# Altium schematic sheet POWER.SchDoc
size A4; SheetNumber: 3; SheetTotal: 4
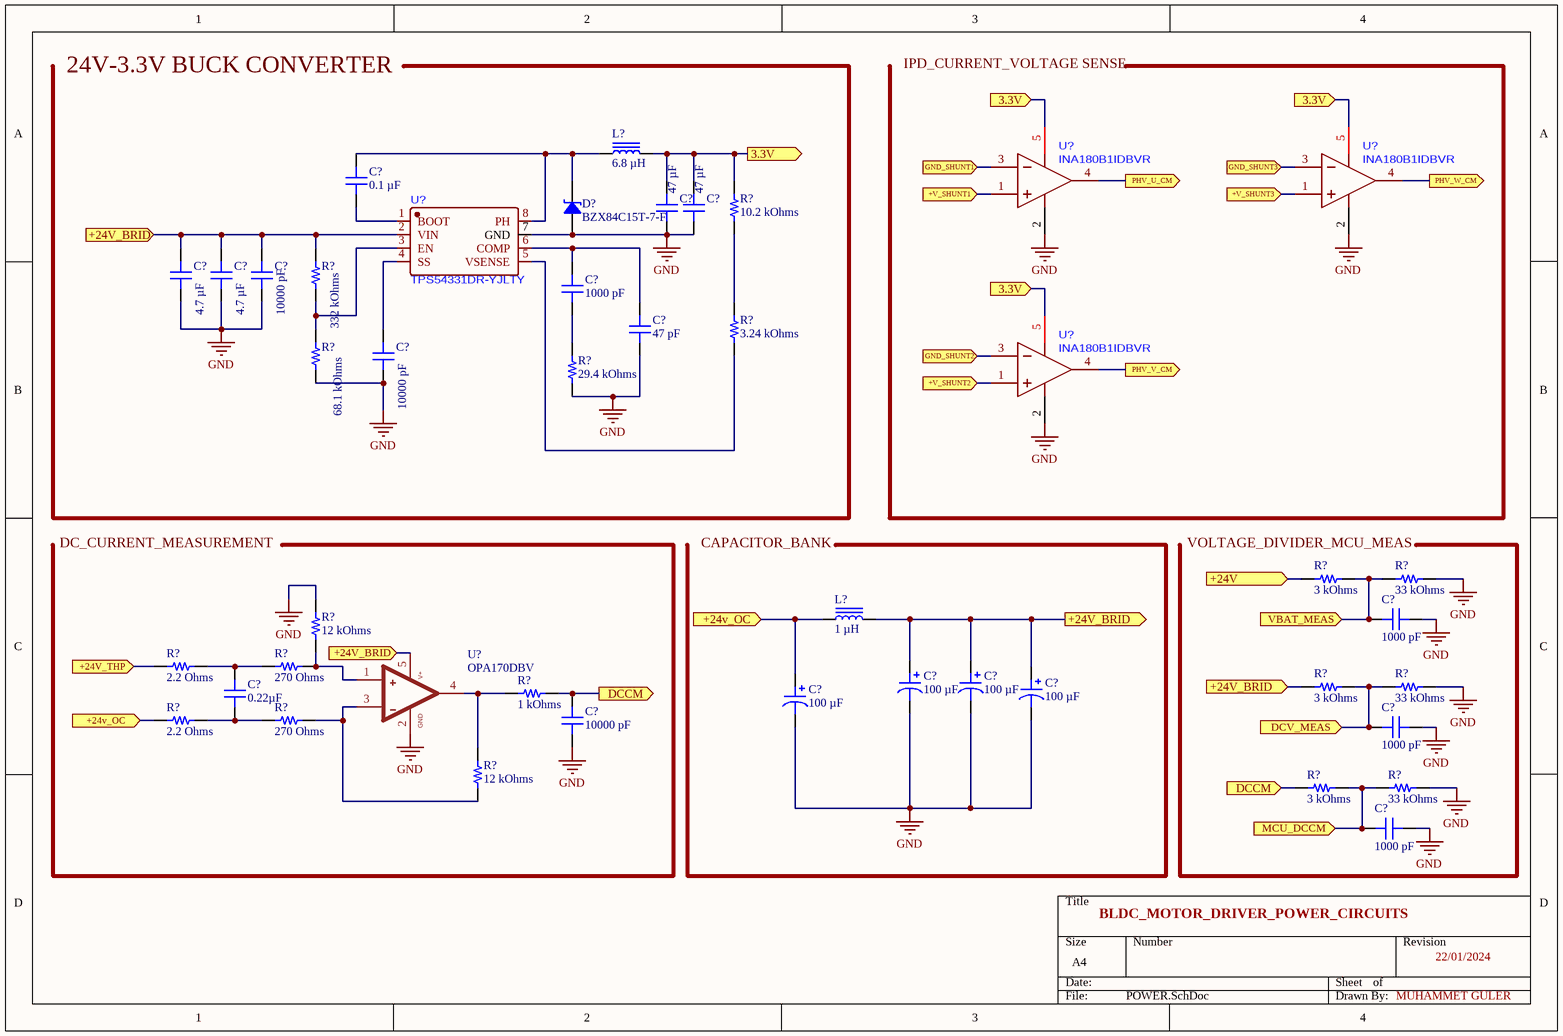
[diagram p0: POWER.SchDoc]

## Parts
(Parts that share a designator on the sheet are numbered #1, #2 ... from top to bottom, then left to right.)
C?#1  0.1 µF  [CAP 1210_3225 - 1MM]
C?#2  47 µF  [CAP 1210_3225 - 1MM]
C?#3  47 µF  [CAP 1210_3225 - 1MM]
C?#4  4.7 µF  [CAP 1210_3225 - 1MM]
C?#5  4.7 µF  [CAP 1210_3225 - 1MM]
C?#6  10000 pF  [CAP 1210_3225 - 1MM]
C?#7  1000 pF  [CAP 1210_3225 - 1MM]
C?#8  47 pF  [CAP 1210_3225 - 1MM]
C?#9  10000 pF  [CAP 1210_3225 - 1MM]
C?#10  1000 pF  [CAP 1210_3225 - 1MM]
C?#11  100 µF  [CAP ALSMD POLY 5.3MM H5.7MM]
C?#12  100 µF  [CAP ALSMD POLY 5.3MM H5.7MM]
C?#13  0.22µF  [CAP 1210_3225 - 2.8MM]
C?#14  100 µF  [CAP ALSMD POLY 5.3MM H5.7MM]
C?#15  100 µF  [CAP ALSMD POLY 5.3MM H5.7MM]
C?#16  10000 pF  [CAP 1210_3225 - 1MM]
C?#17  1000 pF  [CAP 1210_3225 - 1MM]
C?#18  1000 pF  [CAP 1210_3225 - 1MM]
D?  BZX84C15T-7-F  [DIODES SOT-523]
L?#1  6.8 µH  [BOURNS SRP5030T]
L?#2  1 µH  [BOURNS SRP5030T]
R?#1  10.2 kOhms  [RES 1210_3225]
R?#2  332 kOhms  [RES 1210_3225]
R?#3  3.24 kOhms  [RES 1210_3225]
R?#4  68.1 kOhms  [RES 1210_3225]
R?#5  29.4 kOhms  [RES 1210_3225]
R?#6  3 kOhms  [RES 1210_3225]
R?#7  33 kOhms  [RES 1210_3225]
R?#8  12 kOhms  [RES 1210_3225]
R?#9  2.2 Ohms  [RES 1210_3225]
R?#10  270 Ohms  [RES 1210_3225]
R?#11  3 kOhms  [RES 1210_3225]
R?#12  33 kOhms  [RES 1210_3225]
R?#13  1 kOhms  [RES 1210_3225]
R?#14  2.2 Ohms  [RES 1210_3225]
R?#15  270 Ohms  [RES 1210_3225]
R?#16  12 kOhms  [RES 1210_3225]
R?#17  3 kOhms  [RES 1210_3225]
R?#18  33 kOhms  [RES 1210_3225]
U?#1  INA180B1IDBVR  [SOT-23-5_L2.9-W1.6-P0.95-LS2.8-BR]
U?#2  INA180B1IDBVR  [SOT-23-5_L2.9-W1.6-P0.95-LS2.8-BR]
U?#3  TPS54331DR-YJLTY  [SOIC-8_TPS54331]
U?#4  INA180B1IDBVR  [SOT-23-5_L2.9-W1.6-P0.95-LS2.8-BR]
U?#5  OPA170DBV  [SOT-23-5_L2.9-W1.6-P0.95-LS2.8-BR]

## Ports
3.3V (in, see DRIVER[3A], DRIVER[4B], MCU[1B], MCU[1C], MCU[1D], MCU[2A], MCU[2B], MCU[2C], MCU[2D], MCU[3A], MCU[3B], MCU[3D], MCU[4A], MCU[4C], POWER[2A], POWER[3A], POWER[3B], PROTECTION[2D], PROTECTION[4A], PROTECTION[4B]), 3.3V (in, see DRIVER[3A], DRIVER[4B], MCU[1B], MCU[1C], MCU[1D], MCU[2A], MCU[2B], MCU[2C], MCU[2D], MCU[3A], MCU[3B], MCU[3D], MCU[4A], MCU[4C], POWER[2A], POWER[3A], POWER[4A], PROTECTION[2D], PROTECTION[4A], PROTECTION[4B]), 3.3V (in, see DRIVER[3A], DRIVER[4B], MCU[1B], MCU[1C], MCU[1D], MCU[2A], MCU[2B], MCU[2C], MCU[2D], MCU[3A], MCU[3B], MCU[3D], MCU[4A], MCU[4C], POWER[2A], POWER[3B], POWER[4A], PROTECTION[2D], PROTECTION[4A], PROTECTION[4B]), 3.3V (out, see DRIVER[3A], DRIVER[4B], MCU[1B], MCU[1C], MCU[1D], MCU[2A], MCU[2B], MCU[2C], MCU[2D], MCU[3A], MCU[3B], MCU[3D], MCU[4A], MCU[4C], POWER[3A], POWER[3B], POWER[4A], PROTECTION[2D], PROTECTION[4A], PROTECTION[4B]), +24V (in, see PROTECTION[1A]), +24V_BRID (in, see DRIVER[2A], DRIVER[2C], DRIVER[3C], POWER[1A], POWER[1C], POWER[3C]), +24V_BRID (in, see DRIVER[2A], DRIVER[2C], DRIVER[3C], POWER[1A], POWER[3C], POWER[4C]), +24V_BRID (in, see DRIVER[2A], DRIVER[2C], DRIVER[3C], POWER[1C], POWER[3C], POWER[4C]), +24V_BRID (out, see DRIVER[2A], DRIVER[2C], DRIVER[3C], POWER[1A], POWER[1C], POWER[4C]), +24v_OC (in, see POWER[1C], PROTECTION[3B], PROTECTION[3D]), +24v_OC (in, see POWER[2C], PROTECTION[3B], PROTECTION[3D]), +24V_THP (in, see PROTECTION[4B]), +V_SHUNT1 (in, see DRIVER[2B]), +V_SHUNT2 (in, see DRIVER[2D]), +V_SHUNT3 (in, see DRIVER[3D]), DCCM (in, see POWER[2C]), DCCM (out, see POWER[4D]), DCV_MEAS (in, see MCU[3A]), GND_SHUNT1 (in, see DRIVER[2B]), GND_SHUNT2 (in, see DRIVER[2D]), GND_SHUNT3 (in, see DRIVER[3D]), MCU_DCCM (in, see MCU[3B]), PHV_U_CM (out, see MCU[2B], PROTECTION[4A]), PHV_V_CM (out, see MCU[2B], PROTECTION[4A]), PHV_W_CM (out, see MCU[2B], PROTECTION[4A]), VBAT_MEAS (in, see MCU[2B])

## Nets
GND: C?#2.2 C?#3.2 C?#4.2 C?#5.2 C?#6.2 C?#8.2 C?#9.2 C?#10.2 C?#11.2 C?#12.2 C?#14.2 C?#15.2 C?#16.2 C?#17.2 C?#18.2 D?.1 R?#4.2 R?#5.2 R?#7.2 R?#8.1 R?#12.2 R?#18.2 U?#1.2(GND) U?#2.2(GND) U?#3.7(GND) U?#4.2(GND) U?#5.2(GND)
3.3V: C?#2.1 C?#3.1 L?#1.2 R?#1.1 U?#1.5(VS) U?#2.5(VS) U?#4.5(VS) ; port 3.3V
+24V: R?#6.2 ; port +24V
+24V_BRID: C?#4.1 C?#5.1 C?#6.1 C?#11.1 C?#12.1 C?#14.1 L?#2.2 R?#2.1 R?#11.2 U?#3.2(VIN) U?#5.5(V+) ; port +24V_BRID
+24v_OC: C?#15.1 L?#2.1 R?#14.1 ; port +24v_OC
+24V_THP: R?#9.1 ; port +24V_THP
+V_SHUNT1: U?#1.1(IN+) ; port +V_SHUNT1
+V_SHUNT2: U?#4.1(IN+) ; port +V_SHUNT2
+V_SHUNT3: U?#2.1(IN+) ; port +V_SHUNT3
DCCM: C?#16.1 R?#13.2 R?#17.2 ; port DCCM
DCV_MEAS: C?#17.1 R?#11.1 R?#12.1 ; port DCV_MEAS
GND_SHUNT1: U?#1.3(IN-) ; port GND_SHUNT1
GND_SHUNT2: U?#4.3(IN-) ; port GND_SHUNT2
GND_SHUNT3: U?#2.3(IN-) ; port GND_SHUNT3
MCU_DCCM: C?#18.1 R?#17.1 R?#18.1 ; port MCU_DCCM
PHV_U_CM: U?#1.4(OUT) ; port PHV_U_CM
PHV_V_CM: U?#4.4(OUT) ; port PHV_V_CM
PHV_W_CM: U?#2.4(OUT) ; port PHV_W_CM
VBAT_MEAS: C?#10.1 R?#6.1 R?#7.1 ; port VBAT_MEAS
NetC?#1_1: C?#1.1 D?.2 L?#1.1 U?#3.8(PH)
NetC?#1_2: C?#1.2 U?#3.1(BOOT)
NetC?#7_1: C?#7.1 C?#8.1 U?#3.6(COMP)
NetC?#7_2: C?#7.2 R?#5.1
NetC?#9_1: C?#9.1 U?#3.4(SS)
NetC?#13_1: C?#13.1 R?#9.2 R?#10.1
NetC?#13_2: C?#13.2 R?#14.2 R?#15.1
NetR?#1_2: R?#1.2 R?#3.1
NetR?#2_2: R?#2.2 R?#4.1 U?#3.3(EN)
NetR?#3_2: R?#3.2 U?#3.5(VSENSE)
NetR?#8_2: R?#8.2 R?#10.2 U?#5.1(+)
NetR?#13_1: R?#13.1 R?#16.1 U?#5.4(OUT)
NetR?#15_2: R?#15.2 R?#16.2 U?#5.3(-)

## Notes on the sheet
- 24V-3.3V BUCK CONVERTER
- IPD_CURRENT_VOLTAGE SENSE
- DC_CURRENT_MEASUREMENT
- CAPACITOR_BANK
- (near R?#6) VOLTAGE_DIVIDER_MCU_MEAS
- BLDC_MOTOR_DRIVER_POWER_CIRCUITS
- 22/01/2024
- MUHAMMET GÜLER

## Library data of the parts
C?#1 = CAN13X104KARAC7800: CAP CER 1210 0.1UF 250VAC X7R; manufacturer: KEMET; Tolerance: ±10%; Part Number: CAN13X104KARAC7800; Value: 0.1 µF; Applications: Boardflex Sensitive; Capacitance: 0.1 µF; componentlink1description: Datasheet; componentlink1url: //media.digikey.com/pdf/Data%20Sheets/Kemet%20PDFs/CAN13X104KARACTU_Spec.pdf; componentlink2description: DigiKey Link; componentlink2url: https://www.digikey.com/en/products/detail/kemet/CAN13X104KARAC7800/9962480; Device Package: 1210 (3225 Metric); Features: Soft Termination; lastupdated: 14.01.2024 20:41:00; Lifecycle Status: Active; Minimum Order: 1; Mounting Type: Surface Mount, MLCC; Operating Temperature: -55°C ~ 125°C; Package / Case: 1210 (3225 Metric); packaging: TapeAndReel; partid: 23615; Part Status: Active; price: 0.37; series: CAN SMD Indust X7R; Size / Dimension: 0.130" L x 0.102" W (3.30mm x 2.60mm); Supplier 1: DigiKey; Supplier Part Number 1: 399-20611-1-ND; Temperature Coefficient: X7R; Thickness (Max): 0.110" (2.80mm); Voltage - Rated: 250VAC
C?#2 C?#3 = GRM32EC81C476KE15L: CAP CER 47UF 16V X6S 1210; manufacturer: Murata Electronics; Tolerance: ±10%; Part Number: GRM32EC81C476KE15L; Value: 47 µF; Applications: General Purpose; Capacitance: 47 µF; componentlink1description: Datasheet; componentlink1url: https://search.murata.co.jp/Ceramy/image/img/A01X/G101/ENG/GRM32EC81C476KE15-01.pdf; componentlink2description: DigiKey Link; componentlink2url: https://www.digikey.com/en/products/detail/murata-electronics/GRM32EC81C476KE15L/5027615; Device Package: 1210 (3225 Metric); lastupdated: 14.01.2024 20:40:59; Lifecycle Status: Active; Minimum Order: 1; Mounting Type: Surface Mount, MLCC; Operating Temperature: -55°C ~ 105°C; Package / Case: 1210 (3225 Metric); packaging: TapeAndReel; partid: 23627; Part Status: Active; price: 0.10; series: GRM; Size / Dimension: 0.126" L x 0.098" W (3.20mm x 2.50mm); Supplier 1: DigiKey; Supplier Part Number 1: 490-10531-1-ND; Temperature Coefficient: X6S; Thickness (Max): 0.106" (2.70mm); Voltage - Rated: 16V
C?#4 C?#5 = UMK325B7475KMHP: CAP CER 4.7UF 50V X7R 1210; manufacturer: Taiyo Yuden; Tolerance: ±10%; Part Number: UMK325B7475KMHP; Value: 4.7 µF; Applications: Automotive, SMPS Filtering; Capacitance: 4.7 µF; componentlink1description: Datasheet; componentlink1url: https://ds.yuden.co.jp/TYCOMPAS/ut/detail?pn=UMK325B7475KMHP &u=M; componentlink2description: DigiKey Link; componentlink2url: https://www.digikey.com/en/products/detail/taiyo-yuden/UMK325B7475KMHP/7404006; Device Package: 1210 (3225 Metric); lastupdated: 14.01.2024 20:40:59; Lifecycle Status: Active; Minimum Order: 1; Mounting Type: Surface Mount, MLCC; Operating Temperature: -55°C ~ 125°C; Package / Case: 1210 (3225 Metric); packaging: TapeAndReel; partid: 23635; Part Status: Active; price: 0.16; Ratings: AEC-Q200; series: M; Size / Dimension: 0.126" L x 0.098" W (3.20mm x 2.50mm); Supplier 1: DigiKey; Supplier Part Number 1: 587-6032-1-ND; Temperature Coefficient: X7R; Thickness (Max): 0.106" (2.70mm); Voltage - Rated: 50V
C?#6 C?#9 = C1210C103KFRAC7800: CAP CER 10000PF 1.5KV X7R 1210; manufacturer: KEMET; Tolerance: ±10%; Voltage - Rated: 1500V (1.5kV); Part Number: C1210C103KFRAC7800; Value: 10000 pF; Applications: General Purpose; Capacitance: 10000 pF; componentlink1description: Datasheet; componentlink1url: https://api.kemet.com/component-edge/download/datasheet/C1210C103KFRAC7800.pdf; componentlink2description: DigiKey Link; componentlink2url: https://www.digikey.com/en/products/detail/kemet/C1210C103KFRAC7800/5879216; Device Package: 1210 (3225 Metric); Features: Low ESL, High Voltage; lastupdated: 14.01.2024 20:40:55; Lifecycle Status: Active; Minimum Order: 1; Mounting Type: Surface Mount, MLCC; Operating Temperature: -55°C ~ 125°C; Package / Case: 1210 (3225 Metric); packaging: TapeAndReel; partid: 24307; Part Status: Active; price: 0.41; series: SMD Comm X7R HV; Size / Dimension: 0.126" L x 0.098" W (3.20mm x 2.50mm); Supplier 1: DigiKey; Supplier Part Number 1: 399-13305-1-ND; Temperature Coefficient: X7R; Thickness (Max): 0.091" (2.30mm)
C?#7 = C3225C0G3A102J200AE: CAP CER 1000PF 1KV C0G/NP0 1210; manufacturer: TDK Corporation; Temperature Coefficient: C0G, NP0; Tolerance: ±5%; Voltage - Rated: 1000V (1kV); Part Number: C3225C0G3A102J200AE; Value: 1000 pF; Applications: Boardflex Sensitive; Capacitance: 1000 pF; componentlink1description: Datasheet; componentlink1url: https://product.tdk.com/info/en/catalog/datasheets/mlcc_commercial_soft_en.pdf?ref_disty=digikey; componentlink2description: DigiKey Link; componentlink2url: https://www.digikey.com/en/products/detail/tdk-corporation/C3225C0G3A102J200AE/8343800; Device Package: 1210 (3225 Metric); Features: Soft Termination, High Voltage; lastupdated: 14.01.2024 20:40:46; Lifecycle Status: Active; Minimum Order: 1; Mounting Type: Surface Mount, MLCC; Operating Temperature: -55°C ~ 125°C; Package / Case: 1210 (3225 Metric); packaging: TapeAndReel; partid: 24368; Part Status: Active; price: 0.46; series: C; Size / Dimension: 0.126" L x 0.098" W (3.20mm x 2.50mm); Supplier 1: DigiKey; Supplier Part Number 1: 445-175422-1-ND; Thickness (Max): 0.091" (2.30mm)
C?#8 = VJ1210A470JXGAT5Z: CAP CER 47PF 1KV C0G/NP0 1210; manufacturer: Vishay Vitramon; Temperature Coefficient: C0G, NP0; Tolerance: ±5%; Voltage - Rated: 1000V (1kV); Part Number: VJ1210A470JXGAT5Z; Value: 47 pF; Applications: General Purpose; Capacitance: 47 pF; componentlink1description: Datasheet; componentlink1url: http://www.vishay.com/docs/45197/vjhvarcguard.pdf; componentlink2description: DigiKey Link; componentlink2url: https://www.digikey.com/en/products/detail/vishay-vitramon/VJ1210A470JXGAT5Z/1559967; Device Package: 1210 (3225 Metric); Features: High Voltage; lastupdated: 14.01.2024 20:40:54; Lifecycle Status: Active; Minimum Order: 1; Mounting Type: Surface Mount, MLCC; Operating Temperature: -55°C ~ 125°C; Package / Case: 1210 (3225 Metric); packaging: CutTape; partid: 24733; Part Status: Active; price: 0.63; series: VJ HVArc Guard™; Size / Dimension: 0.126" L x 0.098" W (3.20mm x 2.50mm); Supplier 1: DigiKey; Supplier Part Number 1: 720-1040-2-ND; Thickness (Max): 0.067" (1.70mm)
C?#10 C?#17 C?#18 = C1210C102KDRACAUTO: CAP CER 1210 1NF 1000V X7R 10%; manufacturer: KEMET; Voltage - Rated: 1000V (1kV); Part Number: C1210C102KDRACAUTO; Value: 1000 pF; Applications: Automotive, Bypass, Decoupling; Capacitance: 1000 pF; componentlink1description: Datasheet; componentlink1url: https://api.kemet.com/component-edge/download/datasheet/C1210C102KDRACAUTO.pdf; componentlink2description: DigiKey Link; componentlink2url: https://www.digikey.com/en/products/detail/kemet/C1210C102KDRACAUTO/8109922; Device Package: 1210 (3225 Metric); Features: Low ESL, High Voltage; lastupdated: 21.01.2024 20:39:01; Lifecycle Status: Active; Minimum Order: 1; Mounting Type: Surface Mount, MLCC; Operating Temperature: -55°C ~ 125°C; Package / Case: 1210 (3225 Metric); packaging: TapeAndReel; partid: 39963; Part Status: Active; price: 0.38; Ratings: AEC-Q200; series: SMD Auto X7R HV; Size / Dimension: 0.126" L x 0.098" W (3.20mm x 2.50mm); Supplier 1: DigiKey; Supplier Part Number 1: 399-16741-1-ND; Temperature Coefficient: X7R; Thickness (Max): 0.075" (1.90mm); Tolerance: ±10%
C?#11 C?#12 C?#14 C?#15 = RFS0J101MCN1GS: CAP ALUM POLY 100UF 20% 6.3V SMD; manufacturer: Nichicon; ESR (Equivalent Series Resistance): 24mOhm; Lifetime @ Temp.: 2000 Hrs @ 105°C; Ripple Current @ High Frequency: 2.5 A @ 100 kHz; Ripple Current @ Low Frequency: 250 mA @ 120 Hz; Surface Mount Land Size: 0.209" L x 0.209" W (5.30mm x 5.30mm); Type: Polymer; Part Number: RFS0J101MCN1GS; Applications: General Purpose; Capacitance: 100 µF; componentlink1description: Datasheet; componentlink1url: http://nichicon-us.com/english/products/pdfs/e-rfs_rfa.pdf; componentlink2description: DigiKey Link; componentlink2url: https://www.digikey.com/en/products/detail/nichicon/RFS0J101MCN1GS/2202794; Device Package: Radial, Can - SMD; Height - Seated (Max): 0.224" (5.70mm); lastupdated: 13.01.2024 21:35:56; Lifecycle Status: Active; Minimum Order: 1; Mounting Type: Surface Mount; Operating Temperature: -55°C ~ 105°C; Package / Case: Radial, Can - SMD; packaging: TapeAndReel; partid: 1897; Part Status: Active; price: 0.25; series: FPCAP, RFS; Size / Dimension: 0.197" Dia (5.00mm); Supplier 1: DigiKey; Supplier Part Number 1: 493-3680-1-ND; Tolerance: ±20%; value: 100 µF; Voltage - Rated: 6.3 V
C?#13 = 12102C224KAT2A: CAP CER 0.22UF 200V X7R 1210; manufacturer: AVX Corporation; Tolerance: ±10%; Part Number: 12102C224KAT2A; Value: 0.22µF; Applications: General Purpose; Capacitance: 0.22µF; componentlink1description: Datasheet; componentlink1url: http://datasheets.avx.com/X7RDielectric.pdf; componentlink2description: DigiKey Link; componentlink2url: http://digikey.com/product-detail/en/avx-corporation/12102C224KAT2A/478-9968-1-ND/6149086; Device Package: 1210 (3225 Metric); lastupdated: 2.09.2020 01:10:52; Lifecycle Status: Active; Minimum Order: 1; Mounting Type: Surface Mount, MLCC; Operating Temperature: -55°C ~ 125°C; Package / Case: 1210 (3225 Metric); packaging: TapeAndReel; partid: 23738; Part Status: Active; price: 0.31; series: -; Size / Dimension: 0.126" L x 0.098" W (3.20mm x 2.50mm); Supplier 1: DigiKey; Supplier Part Number 1: 478-9968-1-ND; Temperature Coefficient: X7R; Thickness (Max): 0.110" (2.79mm); Voltage - Rated: 200V
C?#16 = C1210X103JDGACAUTO: CAP CER 1210 10NF 1000V C0G 5%; manufacturer: KEMET; Temperature Coefficient: C0G, NP0; Voltage - Rated: 1000V (1kV); Part Number: C1210X103JDGACAUTO; Value: 10000 pF; Applications: Automotive, Boardflex Sensitive; Capacitance: 10000 pF; componentlink1description: Datasheet; componentlink1url: https://api.kemet.com/component-edge/download/datasheet/C1210X103JDGACAUTO.pdf; componentlink2description: DigiKey Link; componentlink2url: https://www.digikey.com/en/products/detail/kemet/C1210X103JDGACAUTO/10131738; Device Package: 1210 (3225 Metric); Features: Low ESL, Soft Termination, High Voltage; lastupdated: 20.01.2024 20:42:10; Lifecycle Status: Active; Minimum Order: 1; Mounting Type: Surface Mount, MLCC; Operating Temperature: -55°C ~ 125°C; Package / Case: 1210 (3225 Metric); packaging: TapeAndReel; partid: 24146; Part Status: Active; price: 0.96; Ratings: AEC-Q200; series: SMD Auto C0G HV Flex; Size / Dimension: 0.130" L x 0.102" W (3.30mm x 2.60mm); Supplier 1: DigiKey; Supplier Part Number 1: 399-20934-1-ND; Thickness (Max): 0.110" (2.80mm); Tolerance: ±5%
D? = BZX84C15T-7-F: DIODE ZENER 15V 150MW SOT523; Manufacturer: Diodes Incorporated; Current - Reverse Leakage @ Vr: 100 nA @ 10.5 V; Impedance (Max) (Zzt): 30 Ohms; Tolerance: ±6.12%; Voltage - Forward (Vf) (Max) @ If: 900 mV @ 10 mA; Part Number: BZX84C15T-7-F; ComponentLink1Description: Datasheet; ComponentLink1URL: https://www.diodes.com/assets/Datasheets/ds30262.pdf; ComponentLink2Description: DigiKey Link; ComponentLink2URL: https://www.digikey.com/en/products/detail/diodes-incorporated/BZX84C15T-7-F/1934513; LastUpdated: 13.01.2024 21:35:15; Lifecycle Status: Active; Minimum Order: 1; Mounting Type: Surface Mount; Operating Temperature: -65°C ~ 150°C; Package / Case: SOT-523; Packaging: TapeAndReel; PartId: 776; Part Status: Active; Power - Max: 150 mW; Price: 0.04; Series: -; Supplier 1: DigiKey; Supplier Part Number 1: BZX84C15T-7-FDICT-ND; Supplier Device Package: SOT-523; Voltage - Zener (Nom) (Vz): 15 V
L?#1 = SRP5030T-6R8M: FIXED IND 6.8UH 4A 76.2 MOHM SMD; Manufacturer: Bourns Inc.; Current - Saturation: 4.3A; DC Resistance (DCR): 76.2mOhm Max; Inductance Frequency - Test: 100 kHz; Material - Core: Iron Powder; Shielding: Shielded; Tolerance: ±20%; Type: Drum Core, Wirewound; Part Number: SRP5030T-6R8M; ComponentLink1Description: Datasheet; ComponentLink1URL: https://www.bourns.com/docs/Product-Datasheets/SRP5030T.pdf; ComponentLink2Description: DigiKey Link; ComponentLink2URL: https://www.digikey.com/en/products/detail/bourns-inc/SRP5030T-6R8M/3986086; Current Rating (Amps): 4 A; Device Package: Nonstandard; Height - Seated (Max): 0.118" (3.00mm); Inductance: 6.8 µH; LastUpdated: 13.01.2024 21:36:03; Lifecycle Status: Active; Minimum Order: 1; Mounting Type: Surface Mount; Operating Temperature: -40°C ~ 125°C; Package / Case: Nonstandard; Packaging: TapeAndReel; PartId: 8; Part Status: Active; Price: 0.59; Series: SRP5030T; Size / Dimension: 0.224" L x 0.205" W (5.70mm x 5.20mm); Supplier 1: DigiKey; Supplier Part Number 1: SRP5030T-6R8MCT-ND; Value: 6.8 µH
L?#2 = SRP5030T-1R0M: FIXED IND 1UH 7A 14 MOHM SMD; Manufacturer: Bourns Inc.; Current - Saturation: 11A; DC Resistance (DCR): 14mOhm Max; Inductance Frequency - Test: 100 kHz; Material - Core: Iron Powder; Shielding: Shielded; Tolerance: ±20%; Type: Drum Core, Wirewound; Part Number: SRP5030T-1R0M; ComponentLink1Description: Datasheet; ComponentLink1URL: https://www.bourns.com/docs/Product-Datasheets/SRP5030T.pdf; ComponentLink2Description: DigiKey Link; ComponentLink2URL: https://www.digikey.com/en/products/detail/bourns-inc/SRP5030T-1R0M/3986079; Current Rating (Amps): 7 A; Device Package: Nonstandard; Height - Seated (Max): 0.118" (3.00mm); Inductance: 1 µH; LastUpdated: 13.01.2024 21:36:03; Lifecycle Status: Active; Minimum Order: 1; Mounting Type: Surface Mount; Operating Temperature: -40°C ~ 125°C; Package / Case: Nonstandard; Packaging: TapeAndReel; PartId: 3; Part Status: Active; Price: 0.59; Series: SRP5030T; Size / Dimension: 0.224" L x 0.205" W (5.70mm x 5.20mm); Supplier 1: DigiKey; Supplier Part Number 1: SRP5030T-1R0MCT-ND; Value: 1 µH
R?#1 = ERJ-14NF1022U: RES SMD 10.2K OHM 1% 1/2W 1210; Manufacturer: Panasonic Electronic Components; Power (Watts): 0.5W, 1/2W; Temperature Coefficient: ±100ppm/°C; Part Number: ERJ-14NF1022U; ComponentLink1Description: Datasheet; ComponentLink1URL: https://industrial.panasonic.com/cdbs/www-data/pdf/RDA0000/AOA0000C304.pdf; ComponentLink2Description: DigiKey Link; ComponentLink2URL: https://www.digikey.com/en/products/detail/panasonic-electronic-components/ERJ-14NF1022U/383823; Composition: Thick Film; Device Package: 1210 (3225 Metric); Features: Automotive AEC-Q200; Height - Seated (Max): 0.028" (0.70mm); LastUpdated: 13.01.2024 21:51:27; Lifecycle Status: Active; Minimum Order: 1; Number of Terminations: 2; Operating Temperature: -55°C ~ 155°C; Package / Case: 1210 (3225 Metric); Packaging: TapeAndReel; Part Status: Active; Price: 0.06; Ratings: AEC-Q200; Resistance: 10.2 kOhms; Series: ERJ-14N; Size / Dimension: 0.126" L x 0.098" W (3.20mm x 2.50mm); Supplier 1: DigiKey; Supplier Part Number 1: P10.2KAACT-ND; Supplier Device Package: 1210; Tolerance: ±1%; Value: 10.2 kOhms
R?#2 = CRCW1210332KFKEA: RES SMD 332K OHM 1% 1/2W 1210; Manufacturer: Vishay Dale; Power (Watts): 0.5W, 1/2W; Temperature Coefficient: ±100ppm/°C; Part Number: CRCW1210332KFKEA; ComponentLink1Description: Datasheet; ComponentLink1URL: http://www.vishay.com/docs/20035/dcrcwe3.pdf; ComponentLink2Description: DigiKey Link; ComponentLink2URL: https://www.digikey.com/en/products/detail/vishay-dale/CRCW1210332KFKEA/1177470; Composition: Thick Film; Device Package: 1210 (3225 Metric); Features: Automotive AEC-Q200; Height - Seated (Max): 0.024" (0.60mm); LastUpdated: 13.01.2024 21:51:20; Lifecycle Status: Active; Minimum Order: 1; Number of Terminations: 2; Operating Temperature: -55°C ~ 155°C; Package / Case: 1210 (3225 Metric); Packaging: TapeAndReel; Part Status: Active; Price: 0.02; Ratings: AEC-Q200; Resistance: 332 kOhms; Series: CRCW; Size / Dimension: 0.126" L x 0.098" W (3.20mm x 2.50mm); Supplier 1: DigiKey; Supplier Part Number 1: 541-332KAACT-ND; Supplier Device Package: 1210; Tolerance: ±1%; Value: 332 kOhms
R?#3 = RK73H2ETTD3241F: RES 3.24K OHM 1% 1/2W 1210; Manufacturer: KOA Speer Electronics, Inc.; Power (Watts): 0.5W, 1/2W; Temperature Coefficient: ±100ppm/°C; Part Number: RK73H2ETTD3241F; ComponentLink1Description: Datasheet; ComponentLink1URL: http://www.koaspeer.com/catimages/Products/RK73H/RK73H.pdf; ComponentLink2Description: DigiKey Link; ComponentLink2URL: https://www.digikey.com/en/products/detail/koa-speer-electronics-inc/RK73H2ETTD3241F/10314446; Composition: Thick Film; Device Package: 1210 (3225 Metric); Features: Automotive AEC-Q200, Moisture Resistant; Height - Seated (Max): 0.028" (0.70mm); LastUpdated: 13.01.2024 21:51:23; Lifecycle Status: Active; Minimum Order: 1; Number of Terminations: 2; Operating Temperature: -55°C ~ 155°C; Package / Case: 1210 (3225 Metric); Packaging: TapeAndReel; Part Status: Active; Price: 0.02; Ratings: AEC-Q200; Resistance: 3.24 kOhms; Series: RK73H; Size / Dimension: 0.126" L x 0.102" W (3.20mm x 2.60mm); Supplier 1: DigiKey; Supplier Part Number 1: 2019-RK73H2ETTD3241FCT-ND; Supplier Device Package: 1210; Tolerance: ±1%; Value: 3.24 kOhms
R?#4 = RMCF1210FT68K1: RES 68.1K OHM 1% 1/3W 1210; Manufacturer: Stackpole Electronics Inc; Power (Watts): 0.333W, 1/3W; Temperature Coefficient: ±100ppm/°C; Part Number: RMCF1210FT68K1; ComponentLink1Description: Datasheet; ComponentLink1URL: https://www.seielect.com/catalog/sei-rmcf_rmcp.pdf; ComponentLink2Description: DigiKey Link; ComponentLink2URL: https://www.digikey.com/en/products/detail/stackpole-electronics-inc/RMCF1210FT68K1/1758602; Composition: Thick Film; Device Package: 1210 (3225 Metric); Features: Automotive AEC-Q200; Height - Seated (Max): 0.028" (0.70mm); LastUpdated: 13.01.2024 21:51:14; Lifecycle Status: Active; Minimum Order: 1; Number of Terminations: 2; Operating Temperature: -55°C ~ 155°C; Package / Case: 1210 (3225 Metric); Packaging: TapeAndReel; Part Status: Active; Price: 0.02; Ratings: AEC-Q200; Resistance: 68.1 kOhms; Series: RMCF; Size / Dimension: 0.126" L x 0.098" W (3.20mm x 2.50mm); Supplier 1: DigiKey; Supplier Part Number 1: RMCF1210FT68K1CT-ND; Supplier Device Package: 1210; Tolerance: ±1%; Value: 68.1 kOhms
R?#5 = CRCW121029K4FKEAHP: RES SMD 29.4K OHM 1% 3/4W 1210; Manufacturer: Vishay Dale; Power (Watts): 0.75W, 3/4W; Temperature Coefficient: ±100ppm/°C; Part Number: CRCW121029K4FKEAHP; ComponentLink1Description: Datasheet; ComponentLink1URL: http://www.vishay.com/docs/20043/crcwhpe3.pdf; ComponentLink2Description: DigiKey Link; ComponentLink2URL: https://www.digikey.com/en/products/detail/vishay-dale/CRCW121029K4FKEAHP/2578005; Composition: Thick Film; Device Package: 1210 (3225 Metric); Features: Automotive AEC-Q200, Pulse Withstanding; Height - Seated (Max): 0.028" (0.70mm); LastUpdated: 13.01.2024 21:51:17; Lifecycle Status: Active; Minimum Order: 1; Number of Terminations: 2; Operating Temperature: -55°C ~ 155°C; Package / Case: 1210 (3225 Metric); Packaging: TapeAndReel; Part Status: Active; Price: 0.13; Ratings: AEC-Q200; Resistance: 29.4 kOhms; Series: CRCW-HP; Size / Dimension: 0.126" L x 0.098" W (3.20mm x 2.50mm); Supplier 1: DigiKey; Supplier Part Number 1: 541-29.4KDCT-ND; Supplier Device Package: 1210; Tolerance: ±1%; Value: 29.4 kOhms
R?#6 R?#11 R?#17 = RK73H2ETTD3001F: RES 3K OHM 1% 1/2W 1210; Manufacturer: KOA Speer Electronics, Inc.; Power (Watts): 0.5W, 1/2W; Temperature Coefficient: ±100ppm/°C; Part Number: RK73H2ETTD3001F; ComponentLink1Description: Datasheet; ComponentLink1URL: http://www.koaspeer.com/catimages/Products/RK73H/RK73H.pdf; ComponentLink2Description: DigiKey Link; ComponentLink2URL: https://www.digikey.com/en/products/detail/koa-speer-electronics-inc/RK73H2ETTD3001F/10314498; Composition: Thick Film; Device Package: 1210 (3225 Metric); Features: Automotive AEC-Q200, Moisture Resistant; Height - Seated (Max): 0.028" (0.70mm); LastUpdated: 21.01.2024 21:39:35; Lifecycle Status: Active; Minimum Order: 1; Number of Terminations: 2; Operating Temperature: -55°C ~ 155°C; Package / Case: 1210 (3225 Metric); Packaging: TapeAndReel; Part Status: Active; Price: 0.02; Ratings: AEC-Q200; Resistance: 3 kOhms; Series: RK73H; Size / Dimension: 0.126" L x 0.102" W (3.20mm x 2.60mm); Supplier 1: DigiKey; Supplier Part Number 1: 2019-RK73H2ETTD3001FCT-ND; Supplier Device Package: 1210; Tolerance: ±1%; Value: 3 kOhms
R?#7 R?#12 R?#18 = RMCF1210JT33K0: RES 33K OHM 5% 1/3W 1210; Manufacturer: Stackpole Electronics Inc; Power (Watts): 0.333W, 1/3W; Temperature Coefficient: ±200ppm/°C; Part Number: RMCF1210JT33K0; ComponentLink1Description: Datasheet; ComponentLink1URL: https://www.seielect.com/catalog/sei-rmcf_rmcp.pdf; ComponentLink2Description: DigiKey Link; ComponentLink2URL: http://digikey.com/product-detail/en/stackpole-electronics-inc/RMCF1210JT33K0/RMCF1210JT33K0CT-ND/1942863; Composition: Thick Film; Device Package: 1210 (3225 Metric); Features: Automotive AEC-Q200; Height - Seated (Max): 0.028" (0.70mm); LastUpdated: 21.01.2024 21:39:28; Lifecycle Status: Active; Minimum Order: 1; Number of Terminations: 2; Operating Temperature: -55°C ~ 155°C; Package / Case: 1210 (3225 Metric); Packaging: TapeAndReel; Part Status: Active; Price: 0.01; Ratings: AEC-Q200; Resistance: 33 kOhms; Series: RMCF; Size / Dimension: 0.126" L x 0.098" W (3.20mm x 2.50mm); Supplier 1: DigiKey; Supplier Part Number 1: RMCF1210JT33K0CT-ND; Supplier Device Package: 1210; Tolerance: ±5%; Value: 33 kOhms
R?#8 R?#16 = TNPW121012K0BEEA: RES 12K OHM 0.1% 1/3W 1210; Manufacturer: Vishay Dale; Power (Watts): 0.333W, 1/3W; Temperature Coefficient: ±25ppm/°C; Part Number: TNPW121012K0BEEA; ComponentLink1Description: Datasheet; ComponentLink1URL: http://www.vishay.com/docs/28758/tnpw_e3.pdf; ComponentLink2Description: DigiKey Link; ComponentLink2URL: https://www.digikey.com/en/products/detail/vishay-dale/TNPW121012K0BEEA/1608502; Composition: Thin Film; Device Package: 1210 (3225 Metric); Features: Anti-Sulfur, Automotive AEC-Q200, Moisture Resistant; Height - Seated (Max): 0.030" (0.75mm); LastUpdated: 19.01.2024 21:50:03; Lifecycle Status: Active; Minimum Order: 1; Number of Terminations: 2; Operating Temperature: -55°C ~ 155°C; Package / Case: 1210 (3225 Metric); Packaging: TapeAndReel; Part Status: Active; Price: 0.64; Ratings: AEC-Q200; Resistance: 12 kOhms; Series: TNPW e3; Size / Dimension: 0.126" L x 0.096" W (3.20mm x 2.45mm); Supplier 1: DigiKey; Supplier Part Number 1: 541-4620-1-ND; Supplier Device Package: 1210; Tolerance: ±0.1%; Value: 12 kOhms
R?#9 R?#14 = SR732ETTD2R20F: CURRENT SENSE RESISTOR; Manufacturer: KOA Speer Electronics, Inc.; Power (Watts): 0.5W, 1/2W; Temperature Coefficient: ±100ppm/°C; Tolerance: ±1%; Part Number: SR732ETTD2R20F; ComponentLink1Description: Datasheet; ComponentLink1URL: https://www.koaspeer.com/catimages/Products/SR73/SR73.pdf; ComponentLink2Description: DigiKey Link; ComponentLink2URL: https://www.digikey.com/en/products/detail/koa-speer-electronics-inc/SR732ETTD2R20F/12747731; Composition: Thick Film; Device Package: 1210 (3225 Metric); Features: Automotive AEC-Q200, Current Sense, Moisture Resistant; Height - Seated (Max): 0.028" (0.70mm); LastUpdated: 19.01.2024 21:49:55; Lifecycle Status: Active; Minimum Order: 1; Number of Terminations: 2; Operating Temperature: -55°C ~ 150°C; Package / Case: 1210 (3225 Metric); Packaging: TapeAndReel; Part Status: Active; Price: 0.11; Ratings: AEC-Q200; Resistance: 2.2 Ohms; Series: SR73; Size / Dimension: 0.126" L x 0.102" W (3.20mm x 2.60mm); Supplier 1: DigiKey; Supplier Part Number 1: 2019-SR732ETTD2R20FCT-ND; Supplier Device Package: 1210; Value: 2.2 Ohms
R?#10 R?#15 = AC1210FR-07270RL: RES SMD 270 OHM 1% 1/2W 1210; Manufacturer: Yageo; Power (Watts): 0.5W, 1/2W; Temperature Coefficient: ±100ppm/°C; Part Number: AC1210FR-07270RL; ComponentLink1Description: Datasheet; ComponentLink1URL: https://www.yageo.com/upload/media/product/productsearch/datasheet/rchip/PYu-AC_51_RoHS_L_10.pdf; ComponentLink2Description: DigiKey Link; ComponentLink2URL: https://www.digikey.com/en/products/detail/yageo/AC1210FR-07270RL/5898147; Composition: Thick Film; Device Package: 1210 (3225 Metric); Features: Automotive AEC-Q200, Moisture Resistant; Height - Seated (Max): 0.024" (0.60mm); LastUpdated: 19.01.2024 21:49:45; Lifecycle Status: Active; Minimum Order: 1; Number of Terminations: 2; Operating Temperature: -55°C ~ 155°C; Package / Case: 1210 (3225 Metric); Packaging: TapeAndReel; Price: 0.02; Ratings: AEC-Q200; Resistance: 270 Ohms; Series: AC; Size / Dimension: 0.122" L x 0.102" W (3.10mm x 2.60mm); Supplier 1: DigiKey; Supplier Part Number 1: 13-AC1210FR-07270RLCT-ND; Supplier Device Package: 1210; Tolerance: ±1%; Value: 270 Ohms
R?#13 = RMCF1210JT1K00: RES 1K OHM 5% 1/2W 1210; Manufacturer: Stackpole Electronics Inc; Power (Watts): 0.5W, 1/2W; Temperature Coefficient: ±200ppm/°C; Part Number: RMCF1210JT1K00; ComponentLink1Description: Datasheet; ComponentLink1URL: https://www.seielect.com/catalog/sei-rmcf_rmcp.pdf; ComponentLink2Description: DigiKey Link; ComponentLink2URL: https://www.digikey.com/en/products/detail/stackpole-electronics-inc/RMCF1210JT1K00/1757278; Composition: Thick Film; Device Package: 1210 (3225 Metric); Features: Automotive AEC-Q200; Height - Seated (Max): 0.028" (0.70mm); LastUpdated: 19.01.2024 21:50:10; Lifecycle Status: Active; Minimum Order: 1; Number of Terminations: 2; Operating Temperature: -55°C ~ 155°C; Package / Case: 1210 (3225 Metric); Packaging: TapeAndReel; Part Status: Active; Price: 0.01; Ratings: AEC-Q200; Resistance: 1 kOhms; Series: RMCF; Size / Dimension: 0.126" L x 0.098" W (3.20mm x 2.50mm); Supplier 1: DigiKey; Supplier Part Number 1: RMCF1210JT1K00CT-ND; Supplier Device Package: 1210; Tolerance: ±5%; Value: 1 kOhms